# Altium schematic sheet 14_NTC_TEMPSENSOR.SchDoc
size 420 x 297 mm; SheetNumber: 24; SheetTotal: 36
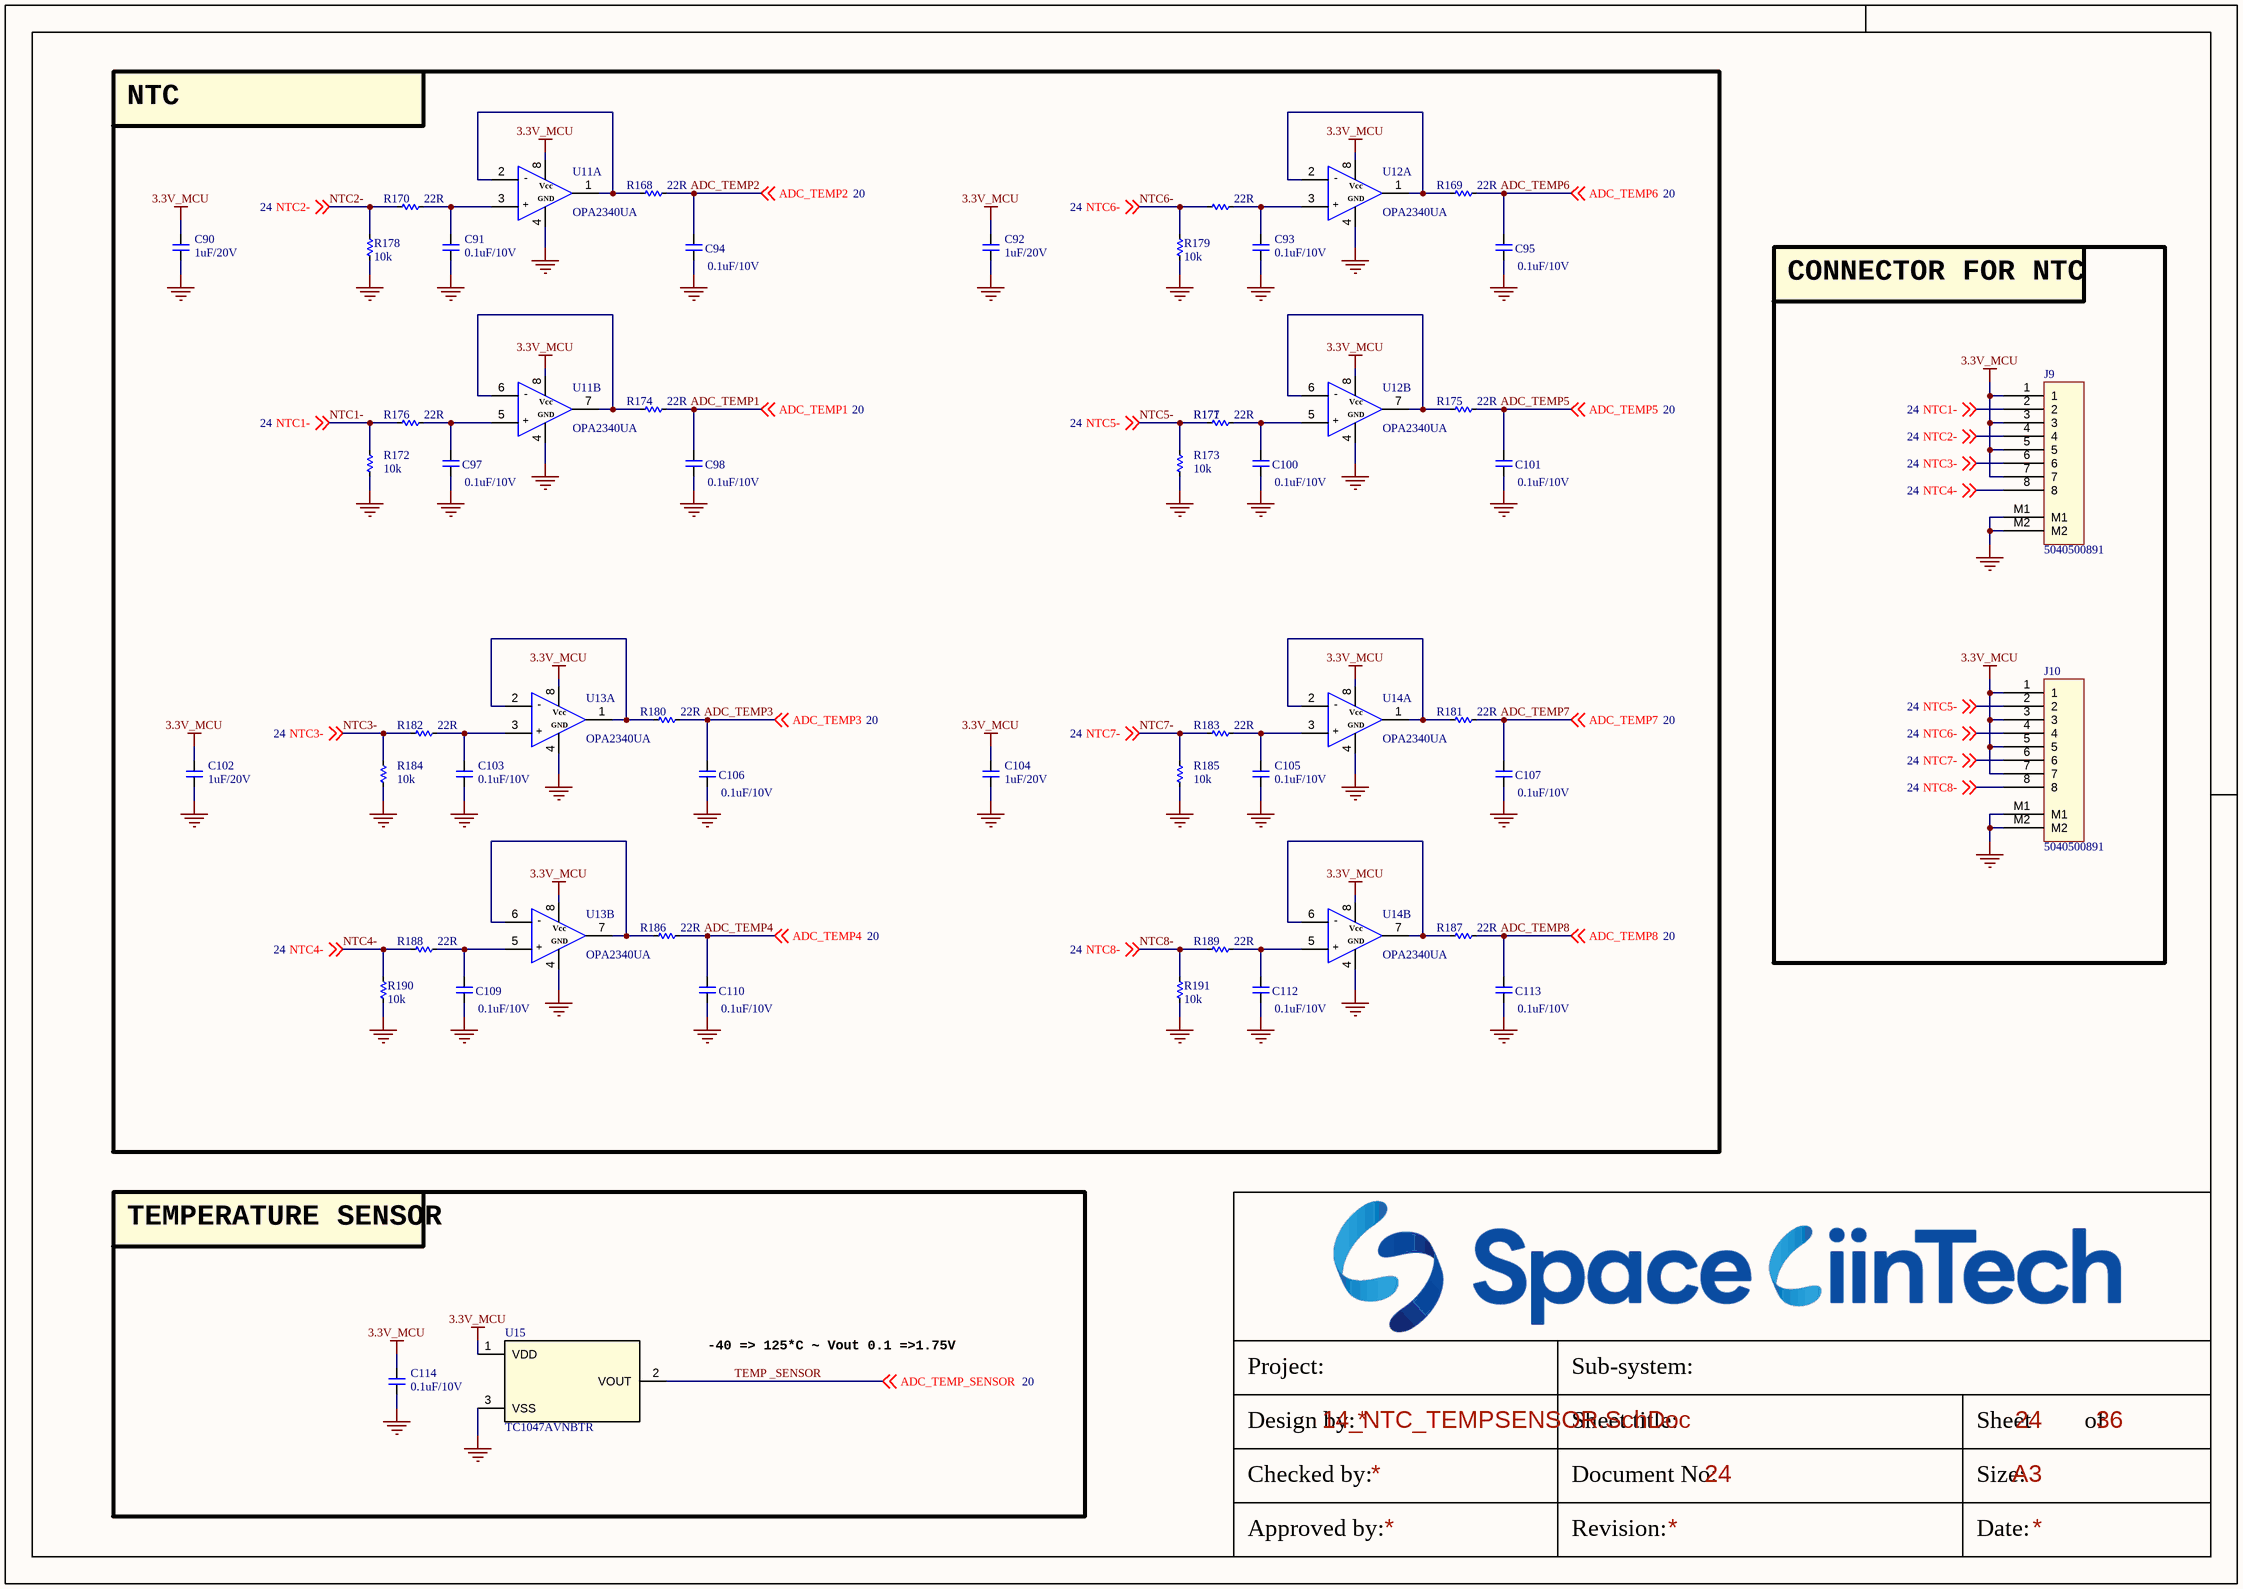
[diagram p0: 14_NTC_TEMPSENSOR.SchDoc]

## Parts
C90  1uF/20V  [CAP_C_1005X50_L]
C91  0.1uF/10V  [CAP_C_1005X50_L]
C92  1uF/20V  [CAP_C_1005X50_L]
C93  0.1uF/10V  [CAP_C_1005X50_L]
C94  0.1uF/10V  [CAP_C_1005X50_L]
C95  0.1uF/10V  [CAP_C_1005X50_L]
C97  0.1uF/10V  [CAP_C_1005X50_L]
C98  0.1uF/10V  [CAP_C_1005X50_L]
C100  0.1uF/10V  [CAP_C_1005X50_L]
C101  0.1uF/10V  [CAP_C_1005X50_L]
C102  1uF/20V  [CAP_C_1005X50_L]
C103  0.1uF/10V  [CAP_C_1005X50_L]
C104  1uF/20V  [CAP_C_1005X50_L]
C105  0.1uF/10V  [CAP_C_1005X50_L]
C106  0.1uF/10V  [CAP_C_1005X50_L]
C107  0.1uF/10V  [CAP_C_1005X50_L]
C109  0.1uF/10V  [CAP_C_1005X50_L]
C110  0.1uF/10V  [CAP_C_1005X50_L]
C112  0.1uF/10V  [CAP_C_1005X50_L]
C113  0.1uF/10V  [CAP_C_1005X50_L]
C114  0.1uF/10V  [CAP_C_1005X50_L]
J9  5040500891  [MOLEX_5040500891]
J10  5040500891  [MOLEX_5040500891]
R168  22R  [RES_C_1005x30_L]
R169  22R  [RES_C_1005x30_L]
R170  22R  [RES_C_1005x30_L]
R171  22R  [RES_C_1005x30_L]
R172  10k  [RES_C_1005x30_L]
R173  10k  [RES_C_1005x30_L]
R174  22R  [RES_C_1005x30_L]
R175  22R  [RES_C_1005x30_L]
R176  22R  [RES_C_1005x30_L]
R177  22R  [RES_C_1005x30_L]
R178  10k  [RES_C_1005x30_L]
R179  10k  [RES_C_1005x30_L]
R180  22R  [RES_C_1005x30_L]
R181  22R  [RES_C_1005x30_L]
R182  22R  [RES_C_1005x30_L]
R183  22R  [RES_C_1005x30_L]
R184  10k  [RES_C_1005x30_L]
R185  10k  [RES_C_1005x30_L]
R186  22R  [RES_C_1005x30_L]
R187  22R  [RES_C_1005x30_L]
R188  22R  [RES_C_1005x30_L]
R189  22R  [RES_C_1005x30_L]
R190  10k  [RES_C_1005x30_L]
R191  10k  [RES_C_1005x30_L]
U11  OPA2340UA  [SOIC127P602X173-8N]  (parts A,B of 2)
U12  OPA2340UA  [SOIC127P602X173-8N]  (parts A,B of 2)
U13  OPA2340UA  [SOIC127P602X173-8N]  (parts A,B of 2)
U14  OPA2340UA  [SOIC127P602X173-8N]  (parts A,B of 2)
U15  TC1047AVNBTR  [SOT95P240X120-3N]

## Blocks framed on the sheet
NTC: C90-C95 C97 C98 C100-C107 C109 C110 C112 C113 R168-R191 U11-U14
CONNECTOR FOR NTC: J9 J10
TEMPERATURE SENSOR: C114 U15

## Nets
3.3V_MCU: C90.2 C92.2 C102.2 C104.2 C114.2 J9.1 J9.3 J9.5 J9.7 J10.1 J10.3 J10.5 J10.7 U11.8 U12.8 U13.8 U14.8 U15.1(VDD)
GND: C90.1 C91.1 C92.1 C93.1 C94.1 C95.1 C97.1 C98.1 C100.1 C101.1 C102.1 C103.1 C104.1 C105.1 C106.1 C107.1 C109.1 C110.1 C112.1 C113.1 C114.1 J9.M1 J9.M2 J10.M1 J10.M2 R172.1 R173.1 R178.1 R179.1 R184.1 R185.1 R190.1 R191.1 U11.4 U12.4 U13.4 U14.4 U15.3(VSS)
ADC_TEMP1: C98.2 R174.2 ; off-sheet ADC_TEMP1
ADC_TEMP2: C94.2 R168.2 ; off-sheet ADC_TEMP2
ADC_TEMP3: C106.2 R180.2 ; off-sheet ADC_TEMP3
ADC_TEMP4: C110.2 R186.2 ; off-sheet ADC_TEMP4
ADC_TEMP5: C101.2 R175.2 ; off-sheet ADC_TEMP5
ADC_TEMP6: C95.2 R169.2 ; off-sheet ADC_TEMP6
ADC_TEMP7: C107.2 R181.2 ; off-sheet ADC_TEMP7
ADC_TEMP8: C113.2 R187.2 ; off-sheet ADC_TEMP8
NTC1-: J9.2 R172.2 R176.1 ; off-sheet NTC1-
NTC2-: J9.4 R170.1 R178.2 ; off-sheet NTC2-
NTC3-: J9.6 R182.1 R184.2 ; off-sheet NTC3-
NTC4-: J9.8 R188.1 R190.2 ; off-sheet NTC4-
NTC5-: J10.2 R173.2 R177.1 ; off-sheet NTC5-
NTC6-: J10.4 R171.1 R179.2 ; off-sheet NTC6-
NTC7-: J10.6 R183.1 R185.2 ; off-sheet NTC7-
NTC8-: J10.8 R189.1 R191.2 ; off-sheet NTC8-
TEMP _SENSOR: U15.2(VOUT) ; off-sheet ADC_TEMP_SENSOR  [also labelled ADC_TEMP_SENSOR]
NetC91_2: C91.2 R170.2 U11.3
NetC93_2: C93.2 R171.2 U12.3
NetC97_2: C97.2 R176.2 U11.5
NetC100_2: C100.2 R177.2 U12.5
NetC103_2: C103.2 R182.2 U13.3
NetC105_2: C105.2 R183.2 U14.3
NetC109_2: C109.2 R188.2 U13.5
NetC112_2: C112.2 R189.2 U14.5
NetR168_1: R168.1 U11.1 U11.2
NetR169_1: R169.1 U12.1 U12.2
NetR174_1: R174.1 U11.6 U11.7
NetR175_1: R175.1 U12.6 U12.7
NetR180_1: R180.1 U13.1 U13.2
NetR181_1: R181.1 U14.1 U14.2
NetR186_1: R186.1 U13.6 U13.7
NetR187_1: R187.1 U14.6 U14.7

## Notes on the sheet
- -40 => 125*C ~ Vout 0.1 =>1.75V
- Project:
- Sub-system:
- Design by:
- Sheet title:
- Sheet
- of
- Checked by:
- Approved by:
- Revision:
- Document No:
- Size:
- Date:
- A3
- (in symbol OPA2340UA, part A) -; Vcc; GND; +
- (in symbol OPA2340UA, part B) -; Vcc; GND; +

## Library data of the parts
C90-C95 C97 C98 C100-C107 C109 C110 C112-C114 = _CAP_C_2: CAP
J9 J10 = Header 8x1_2M
R168-R191 = _RES_B_2: RES
U15 = IC_SENSOR_TC1047AVNBTR: Temperature Sensor Analog, Local -40°C ~ 125°C 10mV/°C SOT-23-3